# EAGLE design main (EAGLE 9.3.0)
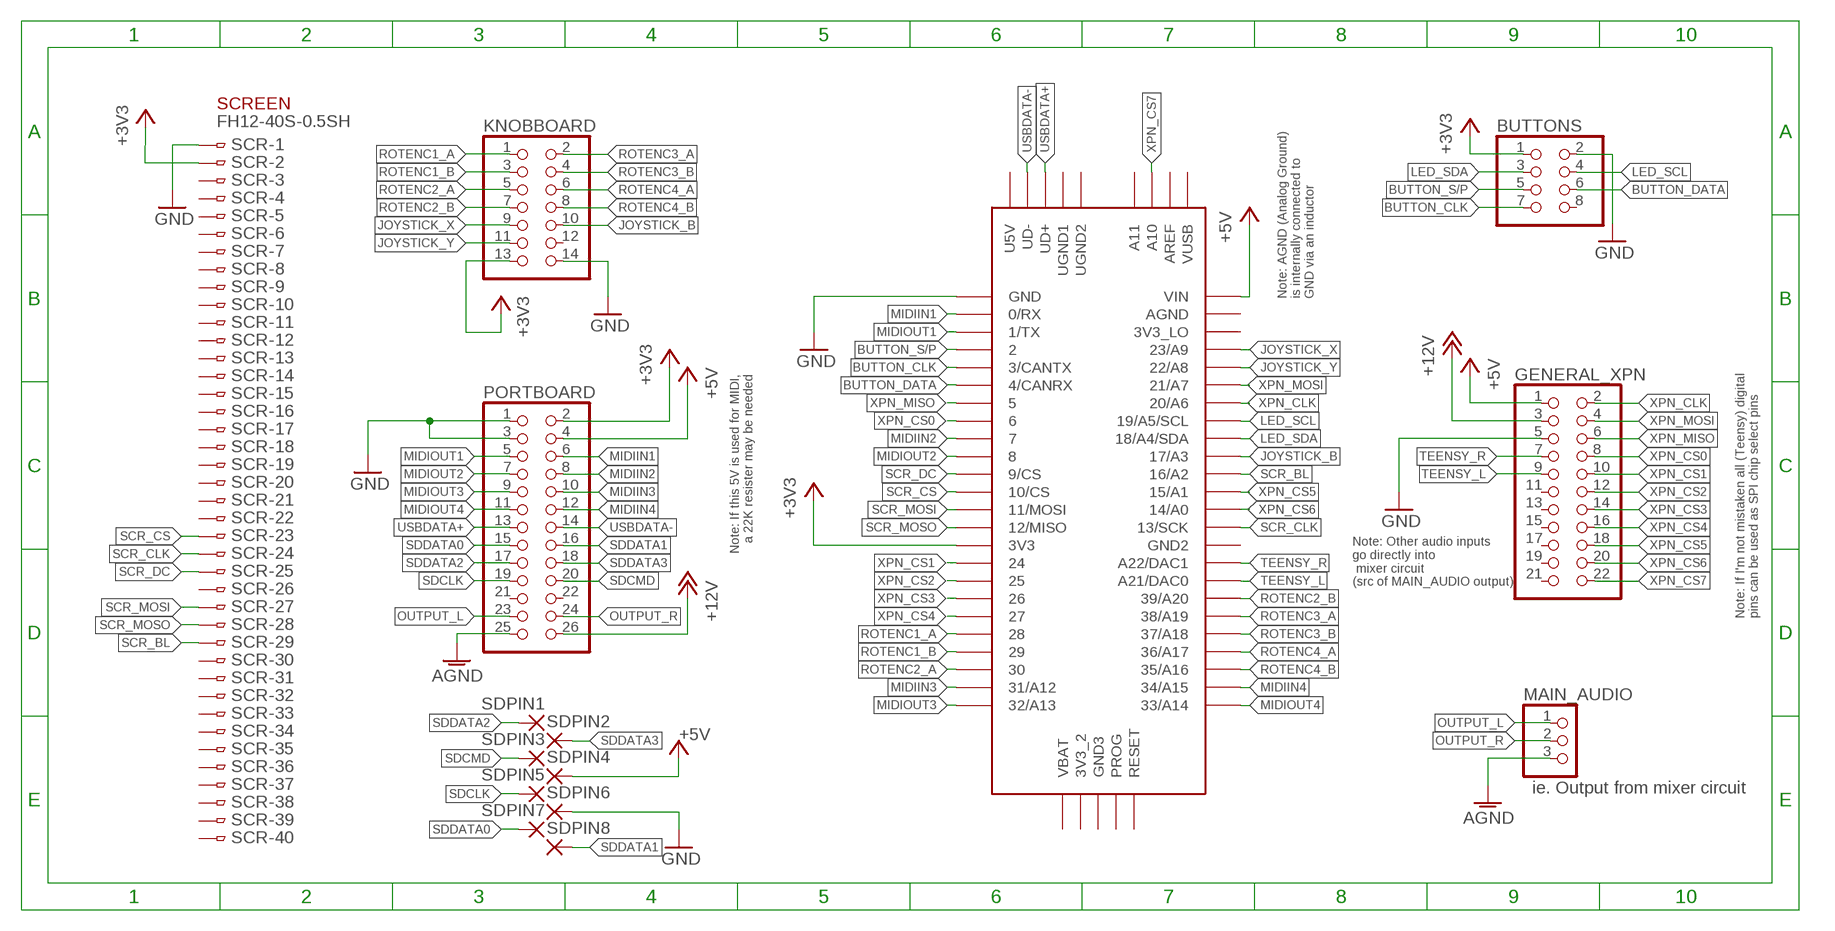
[diagram p0: schematic, sheet 1]

## Parts
BUTTONS  PINHD-2X4  [2X04]
GENERAL_XPN  PINHD-2X11  [2X11]
KNOBBOARD  PINHD-2X7  [2X07]
MAIN_AUDIO  PINHD-1X3  [1X03]
PORTBOARD  PINHD-2X13  [2X13]
SCR  FH12-40S-0.5SH  [FH12-40S-0.5SH]
SDPIN1  1,6/0,8  [1,6/0,8]
SDPIN2  1,6/0,8  [1,6/0,8]
SDPIN3  1,6/0,8  [1,6/0,8]
SDPIN4  1,6/0,8  [1,6/0,8]
SDPIN5  1,6/0,8  [1,6/0,8]
SDPIN6  1,6/0,8  [1,6/0,8]
SDPIN7  1,6/0,8  [1,6/0,8]
SDPIN8  1,6/0,8  [1,6/0,8]
TEENSY_3.6  TEENSY_3.5/3.6  [TEENSY_3.5/3.6]

## Nets
+3V3: BUTTONS.1 KNOBBOARD.13 PORTBOARD.2 SCR.2 TEENSY_3.6.3V3
+5V: GENERAL_XPN.1 PORTBOARD.4 SDPIN4.1(P) TEENSY_3.6.VIN
+12V: GENERAL_XPN.3 PORTBOARD.26
AGND: MAIN_AUDIO.3 PORTBOARD.25
BUTTON_CLK: BUTTONS.7 TEENSY_3.6.3/CANTX
BUTTON_DATA: BUTTONS.6 TEENSY_3.6.4/CANRX
BUTTON_S/P: BUTTONS.5 TEENSY_3.6.2
GND: BUTTONS.2 GENERAL_XPN.5 KNOBBOARD.14 PORTBOARD.1 PORTBOARD.3 SCR.1 SDPIN6.1(P) TEENSY_3.6.GND
JOYSTICK_B: KNOBBOARD.10 TEENSY_3.6.17/A3
JOYSTICK_X: KNOBBOARD.9 TEENSY_3.6.23/A9
JOYSTICK_Y: KNOBBOARD.11 TEENSY_3.6.22/A8
LED_SCL: BUTTONS.4 TEENSY_3.6.19/A5/SCL
LED_SDA: BUTTONS.3 TEENSY_3.6.18/A4/SDA
MIDIIN1: PORTBOARD.6 TEENSY_3.6.0/RX
MIDIIN2: PORTBOARD.8 TEENSY_3.6.7
MIDIIN3: PORTBOARD.10 TEENSY_3.6.31/A12
MIDIIN4: PORTBOARD.12 TEENSY_3.6.34/A15
MIDIOUT1: PORTBOARD.5 TEENSY_3.6.1/TX
MIDIOUT2: PORTBOARD.7 TEENSY_3.6.8
MIDIOUT3: PORTBOARD.9 TEENSY_3.6.32/A13
MIDIOUT4: PORTBOARD.11 TEENSY_3.6.33/A14
OUTPUT_L: MAIN_AUDIO.1 PORTBOARD.23
OUTPUT_R: MAIN_AUDIO.2 PORTBOARD.24
ROTENC1_A: KNOBBOARD.1 TEENSY_3.6.28
ROTENC1_B: KNOBBOARD.3 TEENSY_3.6.29
ROTENC2_A: KNOBBOARD.5 TEENSY_3.6.30
ROTENC2_B: KNOBBOARD.7 TEENSY_3.6.39/A20
ROTENC3_A: KNOBBOARD.2 TEENSY_3.6.38/A19
ROTENC3_B: KNOBBOARD.4 TEENSY_3.6.37/A18
ROTENC4_A: KNOBBOARD.6 TEENSY_3.6.36/A17
ROTENC4_B: KNOBBOARD.8 TEENSY_3.6.35/A16
SCR_BL: SCR.29 TEENSY_3.6.16/A2
SCR_CLK: SCR.24 TEENSY_3.6.13/SCK
SCR_CS: SCR.23 TEENSY_3.6.10/CS
SCR_DC: SCR.25 TEENSY_3.6.9/CS
SCR_MOSI: SCR.27 TEENSY_3.6.11/MOSI
SCR_MOSO: SCR.28 TEENSY_3.6.12/MISO
SDCLK: PORTBOARD.19 SDPIN5.1(P)
SDCMD: PORTBOARD.20 SDPIN3.1(P)
SDDATA0: PORTBOARD.15 SDPIN7.1(P)
SDDATA1: PORTBOARD.16 SDPIN8.1(P)
SDDATA2: PORTBOARD.17 SDPIN1.1(P)
SDDATA3: PORTBOARD.18 SDPIN2.1(P)
TEENSY_L: GENERAL_XPN.9 TEENSY_3.6.21/DAC0(A21/DAC0)
TEENSY_R: GENERAL_XPN.7 TEENSY_3.6.A22/DAC1
USBDATA+: PORTBOARD.13 TEENSY_3.6.UD+
USBDATA-: PORTBOARD.14 TEENSY_3.6.UD-
XPN_CLK: GENERAL_XPN.2 TEENSY_3.6.20/A6
XPN_CS0: GENERAL_XPN.8 TEENSY_3.6.6
XPN_CS1: GENERAL_XPN.10 TEENSY_3.6.24
XPN_CS2: GENERAL_XPN.12 TEENSY_3.6.25
XPN_CS3: GENERAL_XPN.14 TEENSY_3.6.26
XPN_CS4: GENERAL_XPN.16 TEENSY_3.6.27
XPN_CS5: GENERAL_XPN.18 TEENSY_3.6.15/A1
XPN_CS6: GENERAL_XPN.20 TEENSY_3.6.14/A0
XPN_CS7: GENERAL_XPN.22 TEENSY_3.6.A10
XPN_MISO: GENERAL_XPN.6 TEENSY_3.6.5
XPN_MOSI: GENERAL_XPN.4 TEENSY_3.6.21/A7
Unconnected: BUTTONS.8 GENERAL_XPN.11 GENERAL_XPN.13 GENERAL_XPN.15 GENERAL_XPN.17 GENERAL_XPN.19 GENERAL_XPN.21 KNOBBOARD.12 PORTBOARD.21 PORTBOARD.22 SCR.3 SCR.4 SCR.5 SCR.6 SCR.7 SCR.8 SCR.9 SCR.10 SCR.11 SCR.12 SCR.13 SCR.14 SCR.15 SCR.16 SCR.17 SCR.18 SCR.19 SCR.20 SCR.21 SCR.22 SCR.26 SCR.30 SCR.31 SCR.32 SCR.33 SCR.34 SCR.35 SCR.36 SCR.37 SCR.38 SCR.39 SCR.40 TEENSY_3.6.3V3_2 TEENSY_3.6.3V3_LO TEENSY_3.6.A11 TEENSY_3.6.AGND TEENSY_3.6.AREF TEENSY_3.6.GND2 TEENSY_3.6.GND3 TEENSY_3.6.PROG TEENSY_3.6.RESET TEENSY_3.6.U5V TEENSY_3.6.UGND1 TEENSY_3.6.UGND2 TEENSY_3.6.VBAT TEENSY_3.6.VUSB

## Notes on the sheet
- SCREEN
- Note: AGND (Analog Ground) 
  is internally connected to 
  GND via an inductor
- Note: If this 5V is used for MIDI,
  a 22K resister may be needed
- Note: Other audio inputs 
  go directly into
   mixer circuit 
  (src of MAIN_AUDIO output)
- Note: If I'm not mistaken all (Teensy) digital 
  pins can be used as SPI chip select pins
- ie. Output from mixer circuit

## Library data of the parts
BUTTONS = pinhead:PINHD-2X4: PIN HEADER
GENERAL_XPN = pinhead:PINHD-2X11: PIN HEADER
KNOBBOARD = pinhead:PINHD-2X7: PIN HEADER
MAIN_AUDIO = pinhead:PINHD-1X3: PIN HEADER
PORTBOARD = pinhead:PINHD-2X13: PIN HEADER
SCR = con-hirose:FH12-40S-0.5S: 0.5mm Pitch Connectors For FPC/FFC Source: Data sheet <http://www.hirose.co.jp/cataloge_hp/e58605370.pdf>; MPN: FH12-40S-0.5SH(55); OC_FARNELL: 1324556; OC_NEWARK: 34M6178
SDPIN1-SDPIN8 = wirepad:1,6/0,8: THROUGH-HOLE PAD
TEENSY_3.6 = Teensy356:TEENSY_3.5/3.6

## Board
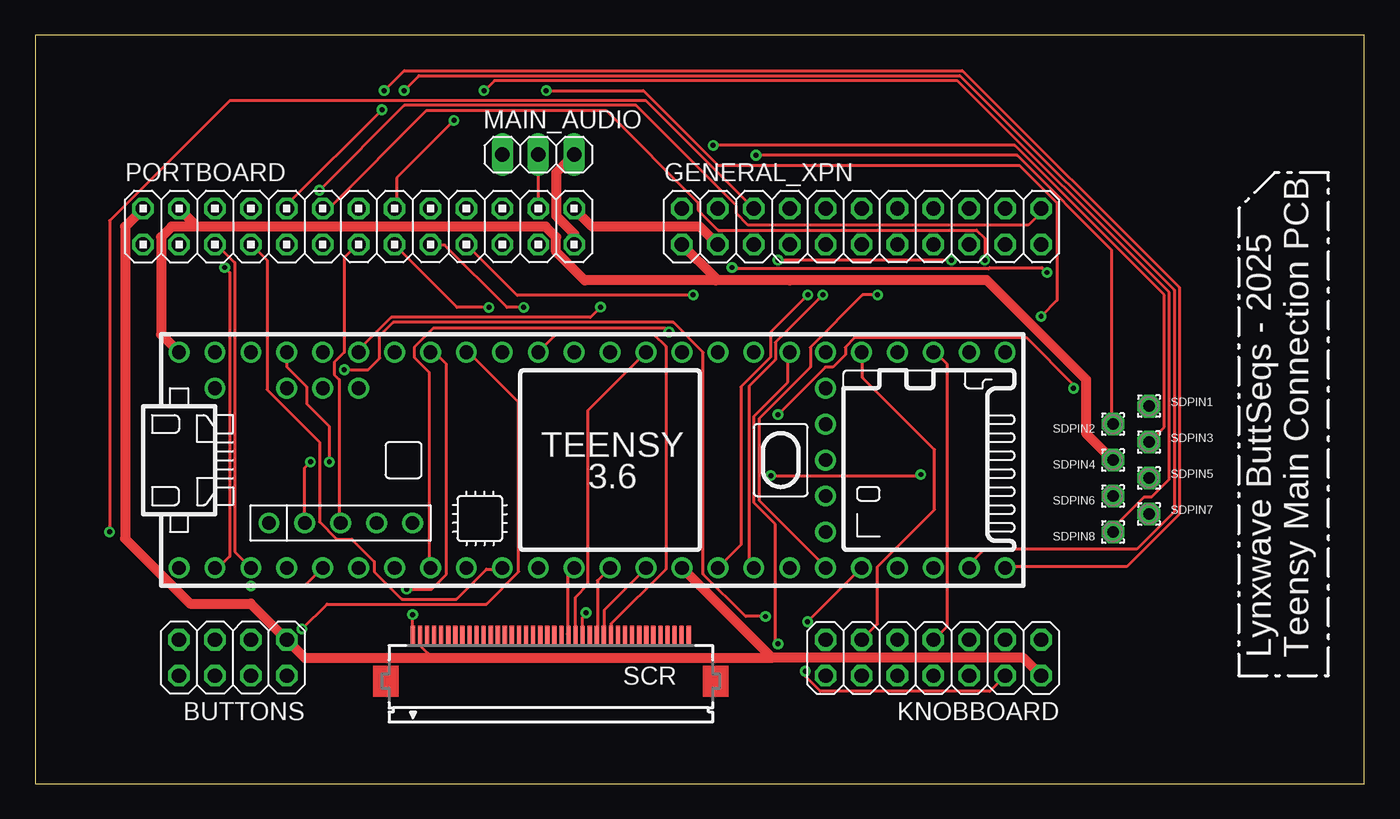
[diagram p1: board, top side]
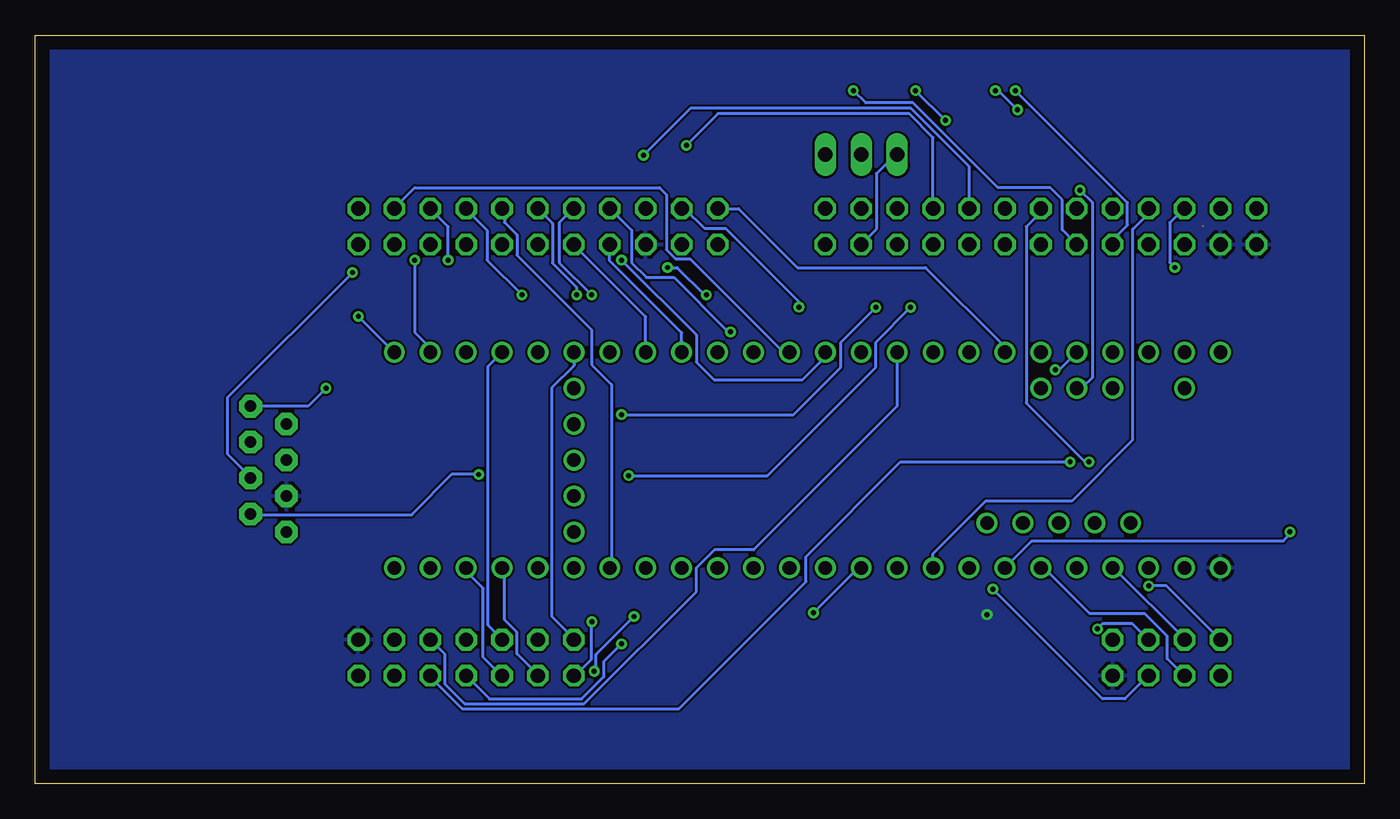
[diagram p2: board, bottom side, seen from below]

Size 93.96 x 52.88 mm. Coordinates in mm from the lower left corner, seen from the top.
Outline: 0,0 93.96,0 93.96,52.88 0,52.88 0,0
Copper layers (1*16): Top 0.035mm / dielectric 1.5mm / Bottom 0.035mm
Design rules "default *": minimum track width 0.2mm, minimum drill 0.35mm, track to track 6mil, track to pad 6mil, pad to pad 6mil, via to via 6mil, smd to smd 6mil, copper to edge 40mil, drill to drill 6mil, minimum pad ring 10mil, minimum via ring 8mil, stop-mask expansion 4mil, vias tented up to drill 0mil, thermal gap 10mil

### Footprints (pad centres in the part's own frame; a part is rotated, then mirrored left to right if it is on the bottom)
2X04 = drill 1.016 octagon: 1 -3.81,-1.27; 2 -3.81,1.27; 3 -1.27,-1.27; 4 -1.27,1.27; 5 1.27,-1.27; 6 1.27,1.27; 7 3.81,-1.27; 8 3.81,1.27
2X11 = drill 1.016 octagon: 1 -12.7,-1.27; 2 -12.7,1.27; 3 -10.16,-1.27; 4 -10.16,1.27; 5 -7.62,-1.27; 6 -7.62,1.27; 7 -5.08,-1.27; 8 -5.08,1.27; 9 -2.54,-1.27; 10 -2.54,1.27; 11 0,-1.27; 12 0,1.27; 13 2.54,-1.27; 14 2.54,1.27; 15 5.08,-1.27; 16 5.08,1.27; 17 7.62,-1.27; 18 7.62,1.27; 19 10.16,-1.27; 20 10.16,1.27; 21 12.7,-1.27; 22 12.7,1.27
2X07 = drill 1.016 octagon: 1 -7.62,-1.27; 2 -7.62,1.27; 3 -5.08,-1.27; 4 -5.08,1.27; 5 -2.54,-1.27; 6 -2.54,1.27; 7 0,-1.27; 8 0,1.27; 9 2.54,-1.27; 10 2.54,1.27; 11 5.08,-1.27; 12 5.08,1.27; 13 7.62,-1.27; 14 7.62,1.27
1X03 = drill 1.016 long: 1 -2.54,0; 2 0,0; 3 2.54,0
2X13 = drill 1.016 octagon: 1 -15.24,-1.27; 2 -15.24,1.27; 3 -12.7,-1.27; 4 -12.7,1.27; 5 -10.16,-1.27; 6 -10.16,1.27; 7 -7.62,-1.27; 8 -7.62,1.27; 9 -5.08,-1.27; 10 -5.08,1.27; 11 -2.54,-1.27; 12 -2.54,1.27; 13 0,-1.27; 14 0,1.27; 15 2.54,-1.27; 16 2.54,1.27; 17 5.08,-1.27; 18 5.08,1.27; 19 7.62,-1.27; 20 7.62,1.27; 21 10.16,-1.27; 22 10.16,1.27; 23 12.7,-1.27; 24 12.7,1.27; 25 15.24,-1.27; 26 15.24,1.27
FH12-40S-0.5SH = smd 0.3 x 1.3: 1 -9.75,3.25; 2 -9.25,3.25; 3 -8.75,3.25; 4 -8.25,3.25; 5 -7.75,3.25; 6 -7.25,3.25; 7 -6.75,3.25; 8 -6.25,3.25; 9 -5.75,3.25; 10 -5.25,3.25; 11 -4.75,3.25; 12 -4.25,3.25; 13 -3.75,3.25; 14 -3.25,3.25; 15 -2.75,3.25; 16 -2.25,3.25; 17 -1.75,3.25; 18 -1.25,3.25; 19 -0.75,3.25; 20 -0.25,3.25; 21 0.25,3.25; 22 0.75,3.25; 23 1.25,3.25; 24 1.75,3.25; 25 2.25,3.25; 26 2.75,3.25; 27 3.25,3.25; 28 3.75,3.25; 29 4.25,3.25; 30 4.75,3.25; 31 5.25,3.25; 32 5.75,3.25; 33 6.25,3.25; 34 6.75,3.25; 35 7.25,3.25; 36 7.75,3.25; 37 8.25,3.25; 38 8.75,3.25; 39 9.25,3.25; 40 9.75,3.25
1,6/0,8 = drill 0.813 pad 1.6 octagon: 1 0,0
TEENSY_3.5/3.6 = drill 0.965: 0/RX -25.4,-7.62; 1/TX -22.86,-7.62; 2 -20.32,-7.62; 3/CANTX -17.78,-7.62; 3V3 7.62,-7.62; 3V3_2 17.78,-2.54; 3V3_LO -22.86,7.62; 4/CANRX -15.24,-7.62; 5 -12.7,-7.62; 6 -10.16,-7.62; 7 -7.62,-7.62; 8 -5.08,-7.62; 9/CS -2.54,-7.62; 10/CS 0,-7.62; 11/MOSI 2.54,-7.62; 12/MISO 5.08,-7.62; 13/SCK 5.08,7.62; 14/A0 2.54,7.62; 15/A1 0,7.62; 16/A2 -2.54,7.62; 17/A3 -5.08,7.62; 18/A4/SDA -7.62,7.62; 19/A5/SCL -10.16,7.62; 20/A6 -12.7,7.62; 21/A7 -15.24,7.62; 21/DAC0 12.7,7.62; 22/A8 -17.78,7.62; 23/A9 -20.32,7.62; 24 10.16,-7.62; 25 12.7,-7.62; 26 15.24,-7.62; 27 17.78,-7.62; 28 20.32,-7.62; 29 22.86,-7.62; 30 25.4,-7.62; 31/A12 27.94,-7.62; 32/A13 30.48,-7.62; 33/A14 30.48,7.62; 34/A15 27.94,7.62; 35/A16 25.4,7.62; 36/A17 22.86,7.62; 37/A18 20.32,7.62; 38/A19 17.78,7.62; 39/A20 15.24,7.62; A10 -17.78,5.08; A11 -15.24,5.08; A22/DAC1 10.16,7.62; AGND -25.4,7.62; AREF -20.32,5.08; GND -27.94,-7.62; GND2 7.62,7.62; GND3 17.78,0; PROG 17.78,2.54; RESET 17.78,5.08; U5V -21.59,-4.445; UD+ -16.51,-4.445; UD- -19.05,-4.445; UGND1 -13.97,-4.445; UGND2 -11.43,-4.445; VBAT 17.78,-5.08; VIN -27.94,7.62; VUSB -25.4,5.08

### Placement (x,y rotation side)
BUTTONS  13.97,8.89 180 top
GENERAL_XPN  58.42,39.37 0 top
KNOBBOARD  63.5,8.89 0 top
MAIN_AUDIO  35.56,44.45 0 top
PORTBOARD  22.86,39.37 0 top
SCR  36.45,7.24 0 top
SDPIN1  78.74,26.67 0 top
SDPIN2  76.2,25.4 0 top
SDPIN3  78.74,24.13 0 top
SDPIN4  76.2,22.86 0 top
SDPIN5  78.74,21.59 0 top
SDPIN6  76.2,20.32 0 top
SDPIN7  78.74,19.05 0 top
SDPIN8  76.2,17.78 0 top
TEENSY_3.6  38.1,22.86 0 top

### Tracks (layer width: path | path; a pad name or v marks a point on that pad's centre or on a via)
+3V3
  Top 0.2: SCR.2 27.25,10.44 27.25,9.71 28.08,8.88
  Top 0.3: 28.08,8.88 29.21,8.88
  Top 0.7: KNOBBOARD.13 69.86,8.88 52.08,8.88 | 52.08,8.88 TEENSY_3.6.3V3 | PORTBOARD.2 6.34,39.36 6.34,17.3 10.93,12.71 15.23,12.71 BUTTONS.1 19.06,8.88 29.21,8.88 52.08,8.88
+5V  (1 unrouted)
  Top 0.2: 48.08,35.74 48.1,35.77 48.1,35.57
  Top 0.7: SDPIN4.1 74.3,24.77 74.3,28.57 67.28,35.59 48.23,35.59 48.08,35.74 GENERAL_XPN.1 | PORTBOARD.4 11.42,39.38 11.41,39.36 9.64,39.36 8.89,38.62 8.89,31.75 TEENSY_3.6.VIN | 53.35,35.57 48.1,35.57 38.85,35.57 36.82,37.59 36.82,38.62 36.08,39.36 11.44,39.36
+12V
  Top 0.7: GENERAL_XPN.3 47,39.36 39.38,39.36 PORTBOARD.26
AGND
  Top 0.7: MAIN_AUDIO.3 36.84,43.19 36.84,40.12 38.1,38.85 PORTBOARD.25
BUTTON_CLK  (via drill 0.35)
  Top 0.2: v15.24,13.97 19.05,13.97 TEENSY_3.6.3/CANTX
  Bottom 0.2: 20.26,15.33 TEENSY_3.6.3/CANTX | BUTTONS.7 13.97,13.97 v15.24,13.97
BUTTON_DATA
  Bottom 0.2: TEENSY_3.6.4/CANRX 22.68,15.24 22.55,15.15 19.41,12.01 15.51,12.01 13.92,10.42 13.92,8.81 12.86,7.75 BUTTONS.6
BUTTON_S/P
  Bottom 0.2: TEENSY_3.6.2 17.62,15.15 17.55,15.15 17.55,15.09 12.69,10.22 BUTTONS.5
GND  (via drill 0.35)
  Top 0.2: SCR.1 26.67,10.49 v26.67,11.94
  pour Bottom: -2.54,54.61 95.25,54.61 95.25,-1.27 -2.54,-1.27
JOYSTICK_B
  Bottom 0.2: 33.02,30.06 TEENSY_3.6.17/A3 33.02,26.67 43.18,16.51 45.95,16.51 47.22,15.24 47.22,13.57 55.15,5.64 63.61,5.64 65.02,7.05 65.02,9.16 65.9,10.04 KNOBBOARD.10
JOYSTICK_X  (via drill 0.35)
  Top 0.2: v20.79,22.73 20.79,25.23 19.21,26.82 19.21,28.02 17.8,29.43 17.8,30.31 TEENSY_3.6.23/A9
  Bottom 0.2: v20.79,22.73 32.77,22.73 39.47,16.03 39.47,14.27 48.45,5.29 63.78,5.29 66.08,7.58 KNOBBOARD.9
JOYSTICK_Y  (via drill 0.35)
  Top 0.2: v51.63,11.8 50.22,11.8 47.22,14.8 47.22,30.48 45.11,32.6 25.31,32.6 24.36,31.65 24.36,30.07 23.54,29.25 v21.85,29.25 | v54.45,7.93 54.45,7.58 55.5,6.52 67.48,6.52 68.54,7.58 KNOBBOARD.11
  Bottom 0.2: v51.63,11.8 54.3,9.13 54.3,8.08 v54.45,7.93 | TEENSY_3.6.22/A8 21.55,29.25 v21.85,29.25
LED_SCL  (via drill 0.35)
  Top 0.2: TEENSY_3.6.19/A5/SCL 28.23,30.48 29.07,29.64 29.07,14.8 28.02,13.74 v26.25,13.74
  Bottom 0.2: v26.25,13.74 18.5,5.99 16.91,5.99 15.33,7.58 BUTTONS.4
LED_SDA  (via drill 0.35)
  Top 0.2: v18.85,10.92 20.61,12.69 31.89,12.69 34.18,14.98 34.18,26.94 30.81,30.31 30.48,30.31 TEENSY_3.6.18/A4/SDA
  Bottom 0.2: v18.85,10.92 18.5,11.28 16.39,11.28 15.33,10.22 BUTTONS.3
MIDIIN1  (via drill 0.35)
  Top 0.2: TEENSY_3.6.0/RX 12.93,15.24 13.74,16.06 13.74,36.12 v13.39,36.47
  Bottom 0.2: v13.39,36.47 13.74,36.83 13.74,39.65 12.86,40.53 PORTBOARD.6
MIDIIN2
  Bottom 0.2: TEENSY_3.6.7 30.48,16.25 26.77,19.96 20.68,19.96 16.36,24.28 16.36,39.19 15.24,40.31 PORTBOARD.8
MIDIIN3  (via drill 0.35)
  Top 0.2: TEENSY_3.6.31/A12 66.04,15.51 67.1,16.56 77.88,16.56 80.52,19.21 80.52,34.89 65.37,50.04 27.14,50.04 v26.08,48.98 | v24.51,47.62 17.78,40.89 PORTBOARD.10
  Bottom 0.2: 17.8,40.7 PORTBOARD.10 | v24.51,47.62 25.87,48.98 v26.08,48.98
MIDIIN4  (via drill 0.35)
  Top 0.2: v67.13,37 67.13,38.53 66.55,39.12 48.28,39.12 46.87,40.53 46.87,41.05 40.35,47.57 27.66,47.57 20.79,40.7 20.44,40.7 PORTBOARD.12
  Bottom 0.2: v67.13,37 67.13,31.89 66.08,30.84 66.08,30.48 TEENSY_3.6.34/A15
MIDIOUT1
  Top 0.2: TEENSY_3.6.1/TX 14.1,16.39 14.1,36.83 12.86,38.06 PORTBOARD.5
MIDIOUT2
  Top 0.2: TEENSY_3.6.8 32.95,15.15 31.89,15.15 29.78,13.04 25.9,13.04 23.96,14.98 23.96,15.68 22.38,17.27 21.32,17.27 20.09,18.5 20.09,24.14 16.39,27.84 16.39,37 15.33,38.06 PORTBOARD.7
MIDIOUT3  (via drill 0.35)
  Top 0.2: v24.67,48.98 26.08,50.39 65.55,50.39 80.88,35.06 80.88,19.03 77.18,15.33 68.72,15.33 TEENSY_3.6.32/A13
  Bottom 0.2: v24.67,48.98 16.74,41.05 16.74,39.47 17.62,38.59 17.62,38.23 PORTBOARD.9
MIDIOUT4  (via drill 0.35)
  Top 0.2: v36.12,48.98 42.99,48.98 48.28,43.7 69.6,43.7 72.24,41.05 72.24,34.14 v71.12,33.02
  Bottom 0.2: v36.12,48.98 35.24,48.1 31.89,48.1 25.9,42.11 22.2,42.11 21.34,41.25 21.34,39.14 20.44,38.23 PORTBOARD.11 | v71.12,33.02 TEENSY_3.6.33/A14
OUTPUT_L
  Bottom 0.2: MAIN_AUDIO.1 33.15,44.45 34.5,43.1 34.5,39.19 35.56,38.13 PORTBOARD.23
OUTPUT_R
  Top 0.2: MAIN_AUDIO.2 PORTBOARD.24
ROTENC1_A  (via drill 0.35)
  Top 0.2: v54.61,11.43 TEENSY_3.6.28
  Bottom 0.2: KNOBBOARD.1 55.78,7.62 54.65,8.75 54.65,11.39 v54.61,11.43
ROTENC1_B
  Bottom 0.2: TEENSY_3.6.29 60.79,15.15 60.79,11.58 59.91,10.7 59.91,9.16 58.5,7.75 KNOBBOARD.3
ROTENC2_A
  Bottom 0.2: TEENSY_3.6.30 63.43,15.15 63.43,14.93 62.3,13.79 62.3,8.91 60.97,7.58 KNOBBOARD.5
ROTENC2_B  (via drill 0.35)
  Top 0.2: v52.51,9.87 52.33,10.04 52.33,18.32 50.82,19.84 50.82,25.98 53.21,28.37 53.21,30.31 TEENSY_3.6.39/A20
  Bottom 0.2: v52.51,9.87 53.78,8.6 53.78,7.54 55.33,5.99 61.85,5.99 63.43,7.58 KNOBBOARD.7
ROTENC3_A
  Bottom 0.2: TEENSY_3.6.38/A19 55.88,29.54 57.42,28 57.42,11.79 55.85,10.22 KNOBBOARD.2
ROTENC3_B
  Top 0.2: TEENSY_3.6.37/A18 58.5,30.31 58.5,28.69 63.59,23.6 63.59,19.36 59.56,15.33 59.56,11.28 58.5,10.22 KNOBBOARD.4
ROTENC4_A
  Bottom 0.2: TEENSY_3.6.36/A17 61.95,29.49 61.95,11.2 60.97,10.22 KNOBBOARD.6
ROTENC4_B
  Top 0.2: TEENSY_3.6.35/A16 63.66,30.48 64.49,29.65 64.49,11.1 63.61,10.22 KNOBBOARD.8
SCR_BL
  Top 0.2: SCR.29 40.7,10.57 40.7,11.28 44.58,15.15 44.58,30.89 43.72,31.75 36.83,31.75 TEENSY_3.6.16/A2
SCR_CLK
  Top 0.2: TEENSY_3.6.13/SCK 39.09,26.39 39.09,14.07 38.2,13.18 SCR.24
SCR_CS
  Top 0.2: SCR.23 37.62,10.57 37.62,14.82 38.04,15.24 TEENSY_3.6.10/CS
SCR_DC  (via drill 0.35)
  Top 0.2: v38.94,12.06 38.94,11.99 38.7,11.76 SCR.25
  Bottom 0.2: v38.94,12.06 35.76,15.24 TEENSY_3.6.9/CS
SCR_MOSI
  Top 0.2: SCR.27 39.75,10.54 39.75,14.35 TEENSY_3.6.11/MOSI
SCR_MOSO
  Top 0.2: SCR.28 40.25,10.54 40.25,12.28 43.18,15.21 TEENSY_3.6.12/MISO
SDCLK  (via drill 0.35)
  Top 0.2: v46.52,34.53 46.49,34.51 34.08,34.51 30.52,38.06 30.48,38.06 PORTBOARD.19 | 71.36,36.3 v71.54,36.12 71.19,36.47 67.5,36.47 67.39,36.37 49.37,36.37 v49.27,36.47
  Bottom 0.2: v46.52,34.53 46.64,34.53 48.58,36.47 v49.27,36.47 | v71.54,36.12 80.35,27.31 80.35,23.26 78.76,21.67 SDPIN5.1
SDCMD  (via drill 0.35)
  Top 0.2: v47.93,45.11 69.25,45.11 79.82,34.53 79.82,25.2 78.76,24.14 SDPIN3.1
  Bottom 0.2: PORTBOARD.20 30.48,45.66 32.16,47.34 45.69,47.34 v47.93,45.11
SDDATA0  (via drill 0.35)
  Top 0.2: PORTBOARD.15 25.4,38.07 29.82,33.65 v32.07,33.65 | v52,21.76 62.53,21.76 v62.61,21.84
  Bottom 0.2: v32.07,33.65 34.53,31.19 34.53,29.43 42.2,21.76 v52,21.76 | SDPIN7.1 78.76,19.03 78.76,19 67.31,19 67.31,19.05 64.52,21.84 v62.61,21.84
SDDATA1  (via drill 0.35)
  Top 0.2: v29.6,46.87 25.55,42.82 25.55,40.7 PORTBOARD.16 | v31.72,48.98 31.76,48.98 32.47,49.69 65.19,49.69 80.17,34.71 80.17,21.5 78.94,20.26 78.41,20.26 76.3,18.15 76.3,17.8 SDPIN8.1
  Bottom 0.2: v31.72,48.98 v29.6,46.87
SDDATA2  (via drill 0.35)
  Top 0.2: v34.53,33.65 33.35,33.65 28.95,38.06 28.02,38.06 PORTBOARD.17 | v52.51,26.08 55.85,29.43 56.38,29.43 57.27,30.31 57.27,30.84 57.97,31.54 70.06,31.54 73.41,28.19 v73.41,27.94
  Bottom 0.2: v34.53,33.65 37,31.19 37,29.43 40.35,26.08 v52.51,26.08 | v73.41,27.94 74.68,26.67 SDPIN1.1
SDDATA3  (via drill 0.35)
  Top 0.2: v50.96,44.4 69.42,44.4 76.12,37.71 76.12,25.55 SDPIN2.1
  Bottom 0.2: PORTBOARD.18 27.93,43.62 32.07,47.75 47.61,47.75 v50.96,44.4
TEENSY_L
  Bottom 0.2: 50.92,30.48 TEENSY_3.6.21/DAC0 50.8,33 55.85,38.06 GENERAL_XPN.9
TEENSY_R
  Bottom 0.2: 48.26,30.46 TEENSY_3.6.A22/DAC1 48.26,31.86 53.39,36.99 53.39,38.05 GENERAL_XPN.7 53.39,38.06
USBDATA+
  Top 0.2: TEENSY_3.6.UD+ 21.5,18.5 21.5,28.54 21.14,28.9 21.14,29.78 21.85,30.48 21.85,37.18 22.73,38.06 PORTBOARD.13
USBDATA-  (via drill 0.35)
  Top 0.2: TEENSY_3.6.UD- 19.05,22.32 v19.46,22.73
  Bottom 0.2: PORTBOARD.14 22.73,40.53 23.89,39.37 23.89,26.88 19.73,22.73 v19.46,22.73
XPN_CLK
  Bottom 0.2: GENERAL_XPN.2 44.23,40.64 40.06,36.47 31.01,36.47 25.55,31.01 25.55,30.48 TEENSY_3.6.20/A6
XPN_CS0  (via drill 0.35)
  Top 0.2: v44.81,31.92 44.56,32.17 28.12,32.17 26.78,30.84 26.78,30.13 27.84,29.07 27.84,15.33 TEENSY_3.6.6
  Bottom 0.2: v44.81,31.92 44.94,31.92 45.07,32.05 45.09,32.05 48.81,35.77 50.75,35.77 51.8,36.83 51.8,39.12 53.21,40.53 GENERAL_XPN.8
XPN_CS1  (via drill 0.35)
  Top 0.2: TEENSY_3.6.24 49.88,16.86 49.88,28.03 51.98,30.13 51.98,31.89 v54.62,34.53
  Bottom 0.2: v54.62,34.53 56.91,36.83 56.91,39.65 56.03,40.53 GENERAL_XPN.10
XPN_CS2  (via drill 0.35)
  Top 0.2: v55.68,34.53 52.33,31.19 52.33,29.95 50.47,28.09 50.47,15.6 50.76,15.3 TEENSY_3.6.25
  Bottom 0.2: v55.68,34.53 55.68,35.06 57.39,36.78 57.39,39.6 58.32,40.53 GENERAL_XPN.12
XPN_CS3
  Bottom 0.2: TEENSY_3.6.26 53.21,15.33 53.21,28.19 54.62,29.6 54.62,32.07 59.91,37.35 59.91,38.78 60.79,39.67 60.79,40.53 GENERAL_XPN.14
XPN_CS4  (via drill 0.35)
  Top 0.2: v59.56,34.53 58.5,34.53 54.8,30.84 54.8,29.43 51.17,25.8 51.17,20.01 55.85,15.33 TEENSY_3.6.27
  Bottom 0.2: v59.56,34.53 62.02,37 62.02,39.12 63.43,40.53 GENERAL_XPN.16
XPN_CS5  (via drill 0.35)
  Top 0.2: v64.77,37 v52.51,37
  Bottom 0.2: TEENSY_3.6.15/A1 38.1,30.16 39.72,28.54 45.99,28.54 47.22,29.78 47.22,31.72 v52.51,37 | v64.77,37 64.77,39.37 GENERAL_XPN.18
XPN_CS6
  Bottom 0.2: TEENSY_3.6.14/A0 40.7,30.48 41.05,30.48 47.66,37.09 48.68,37.09 49.34,37.74 49.34,41.63 49.81,42.11 67.13,42.11 68.54,40.7 GENERAL_XPN.20
XPN_CS7  (via drill 0.35)
  Top 0.2: v20.09,41.94 26.08,47.93 42.46,47.93 49.56,40.83 49.56,40.3 50.39,39.47 70.21,39.47 71.12,40.38 GENERAL_XPN.22
  Bottom 0.2: v20.09,41.94 19.23,41.08 19.23,28.69 19.91,28.02 20.26,28.02 TEENSY_3.6.A10
XPN_MISO  (via drill 0.35)
  Top 0.2: v5.25,17.78 5.25,39.78 13.74,48.28 43.17,48.28 50.75,40.7 GENERAL_XPN.6
  Bottom 0.2: TEENSY_3.6.5 23.5,17.14 5.71,17.14 5.25,17.61 v5.25,17.78
XPN_MOSI  (via drill 0.35)
  Top 0.2: TEENSY_3.6.21/A7 22.86,30.65 25.16,32.95 39.24,32.95 v39.97,33.67
  Bottom 0.2: v39.97,33.67 39.97,34.06 45.16,39.24 46.64,39.24 48.04,40.64 GENERAL_XPN.4

### Text on the board
tPlace: Lynxwave ButtSeqs - 2025 / Teensy Main Connection PCB